# EAGLE design ecoshield (EAGLE 9.6.2)

## Sheet 1 of 2
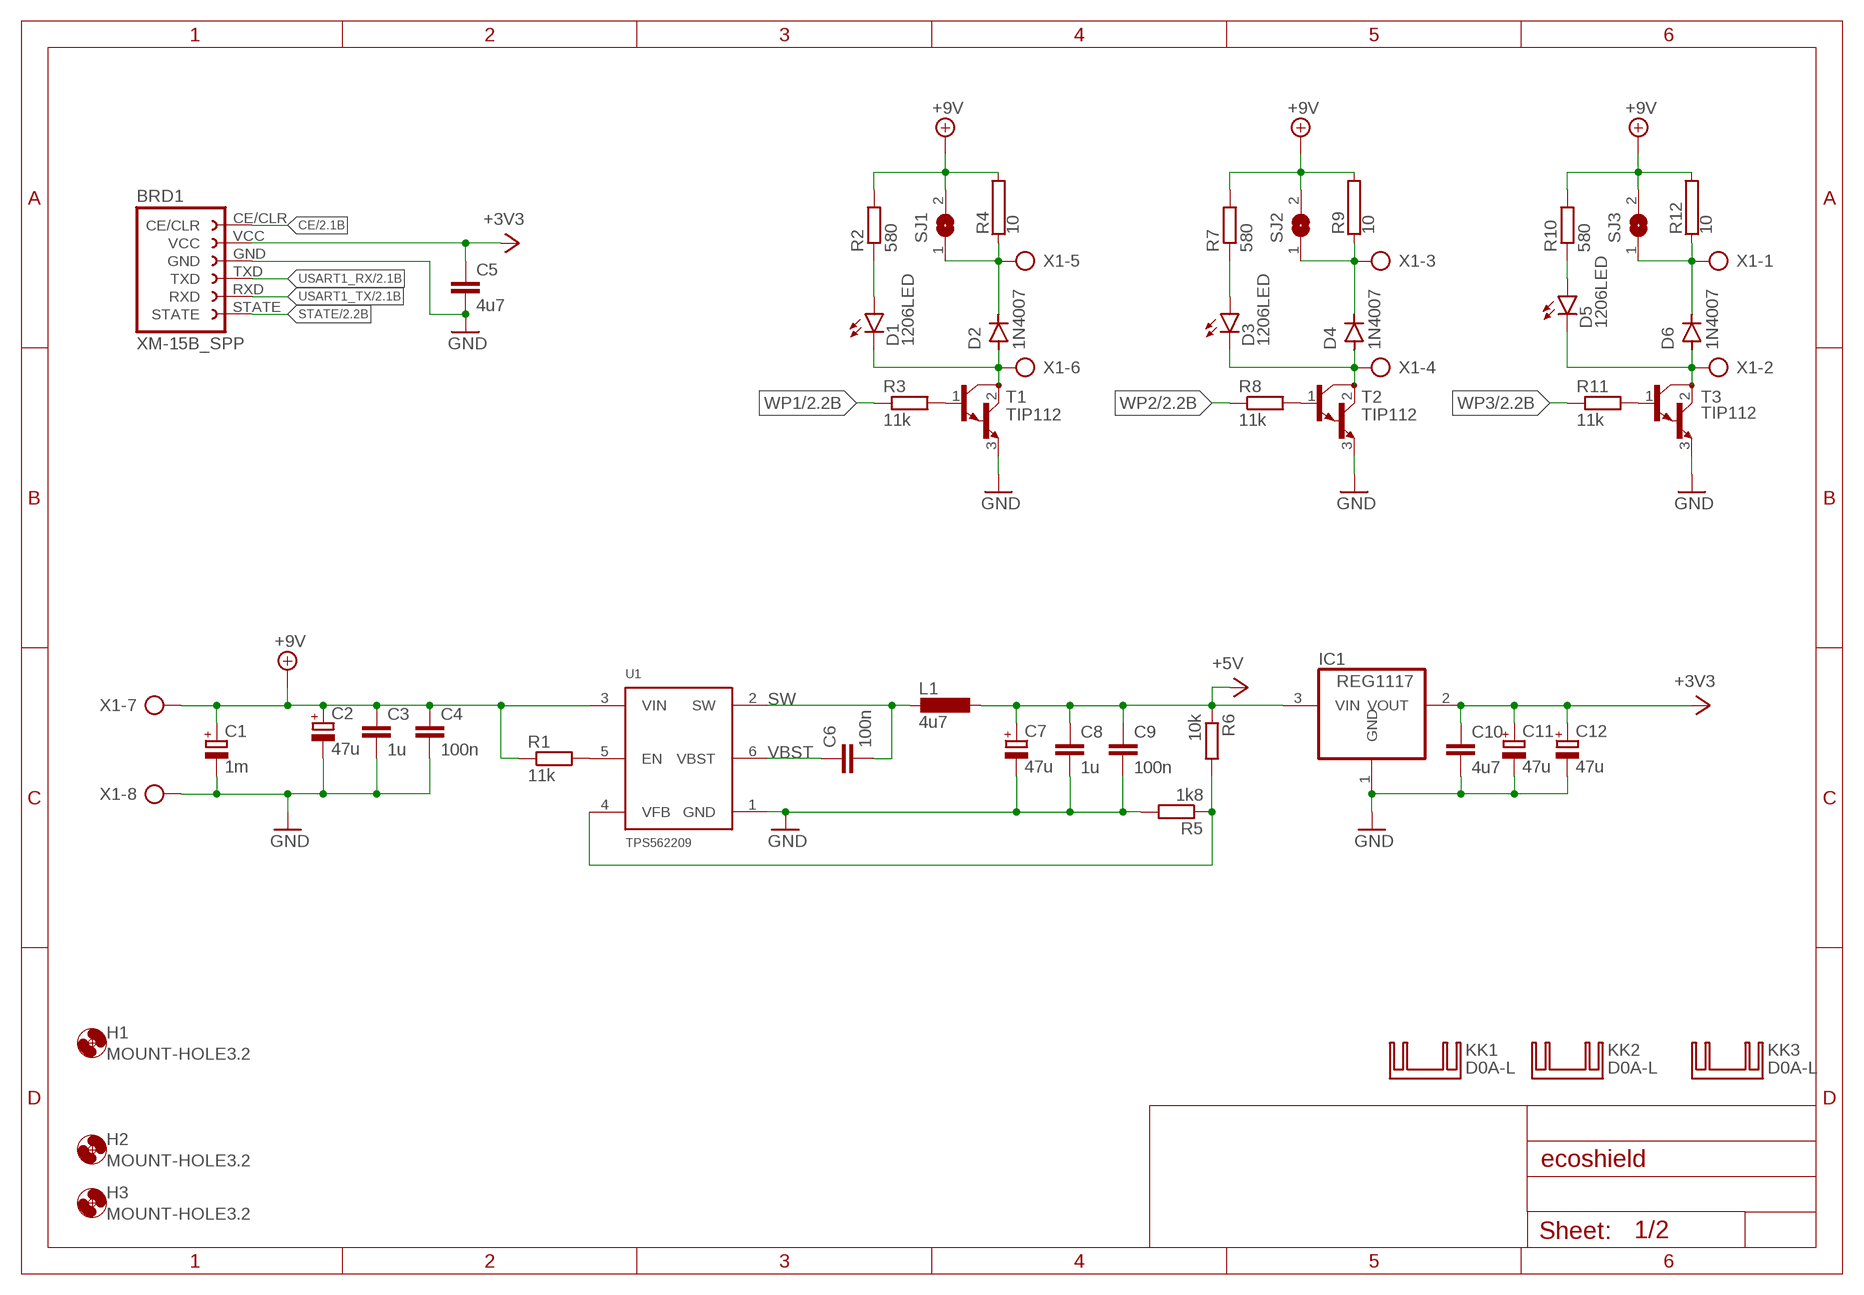
[diagram p0: schematic, sheet 1]

### Parts
BRD1  XM-15B_SPP  [XM-15BSPP]
C1  1m  CPOL-EUE5-10.5  [E5-10,5]
C2  47u  CPOL-EUSMCC  [SMC_C]
C3  1u  C-EUC0805  [C0805]
C4  100n  C-EUC0805  [C0805]
C5  4u7  C-EUC0805  [C0805]
C6  100n  C-EUC0805  [C0805]
C7  47u  CPOL-EUSMCC  [SMC_C]
C8  1u  C-EUC0805  [C0805]
C9  100n  C-EUC0805  [C0805]
C10  4u7  C-EUC0805  [C0805]
C11  47u  CPOL-EUSMCC  [SMC_C]
C12  47u  CPOL-EUSMCC  [SMC_C]
D1  1206LED  [DIOC3216X70N]
D2  1N4007  [DIOMELF4925N]
D3  1206LED  [DIOC3216X70N]
D4  1N4007  [DIOMELF4925N]
D5  1206LED  [DIOC3216X70N]
D6  1N4007  [DIOMELF4925N]
H1  MOUNT-HOLE3.2  [3,2]
H2  MOUNT-HOLE3.2  [3,2]
H3  MOUNT-HOLE3.2  [3,2]
IC1  REG1117  [SOT223]
KK1  D0A-L  [D02A-L]
KK2  D0A-L  [D02A-L]
KK3  D0A-L  [D02A-L]
L1  4u7  744043004  [744043004.]
R1  11k  R-EU_R1206  [R1206]
R2  580  R-EU_R1206  [R1206]
R3  11k  R-EU_R1206  [R1206]
R4  10  RAC05  [AC05]
R5  1k8  R-EU_R1206  [R1206]
R6  10k  R-EU_R1206  [R1206]
R7  580  R-EU_R1206  [R1206]
R8  11k  R-EU_R1206  [R1206]
R9  10  RAC05  [AC05]
R10  580  R-EU_R1206  [R1206]
R11  11k  R-EU_R1206  [R1206]
R12  10  RAC05  [AC05]
SJ1  SJW  [SJW]
SJ2  SJW  [SJW]
SJ3  SJW  [SJW]
T1  TIP112  TIP122  [TO220]
T2  TIP112  TIP122  [TO220]
T3  TIP112  TIP122  [TO220]
U1  TPS562209  [SOT95P280X110-6N]
X1  AK500/8  [AK500/8]

### Nets
+3V3: BRD1.VCC C5.1 C10.1 C11.+ C12.+ IC1.2(VOUT) ; also sheet 2
+5V: C7.+ C8.1 C9.1 IC1.3(VIN) L1.P$1 R6.1
+9V: C1.+ C2.+ C3.1 C4.1 R1.1 R2.2 R4.2 R7.2 R9.2 R10.2 R12.2 SJ1.2 SJ2.2 SJ3.2 U1.3(VIN) X1.7
CE [signal]: BRD1.CE/CLR ; also sheet 2
GND: BRD1.GND C1.- C2.- C3.2 C4.2 C5.2 C7.- C8.2 C9.2 C10.2 C11.- C12.- IC1.1(GND) R5.2 T1.3(E) T2.3(E) T3.3(E) U1.1(GND) X1.8 ; also sheet 2
N$1: R11.2 T3.1(B)
N$2: D3.1(C) D4.2(A) T2.2(C) X1.4
N$3: D4.1(C) R9.1 SJ2.1 X1.3
N$4: R8.2 T2.1(B)
N$5: R1.2 U1.5(EN)
N$6: D6.1(C) R12.1 SJ3.1 X1.1
N$8: D3.2(A) R7.1
N$9: D5.2(A) R10.1
N$10: D5.1(C) D6.2(A) T3.2(C) X1.2
N$11: D1.1(C) D2.2(A) T1.2(C) X1.6
N$12: D2.1(C) R4.1 SJ1.1 X1.5
N$13: R3.2 T1.1(B)
N$15: D1.2(A) R2.1
N$17: R5.1 R6.2 U1.4(VFB)
STATE [signal]: BRD1.STATE ; also sheet 2
SW: C6.2 L1.P$2 U1.2(SW)
USART1_RX [signal]: BRD1.TXD ; also sheet 2
USART1_TX [signal]: BRD1.RXD ; also sheet 2
VBST: C6.1 U1.6(VBST)
WP1 [signal]: R3.1 ; also sheet 2
WP2 [signal]: R8.1 ; also sheet 2
WP3 [signal]: R11.1 ; also sheet 2

## Sheet 2 of 2
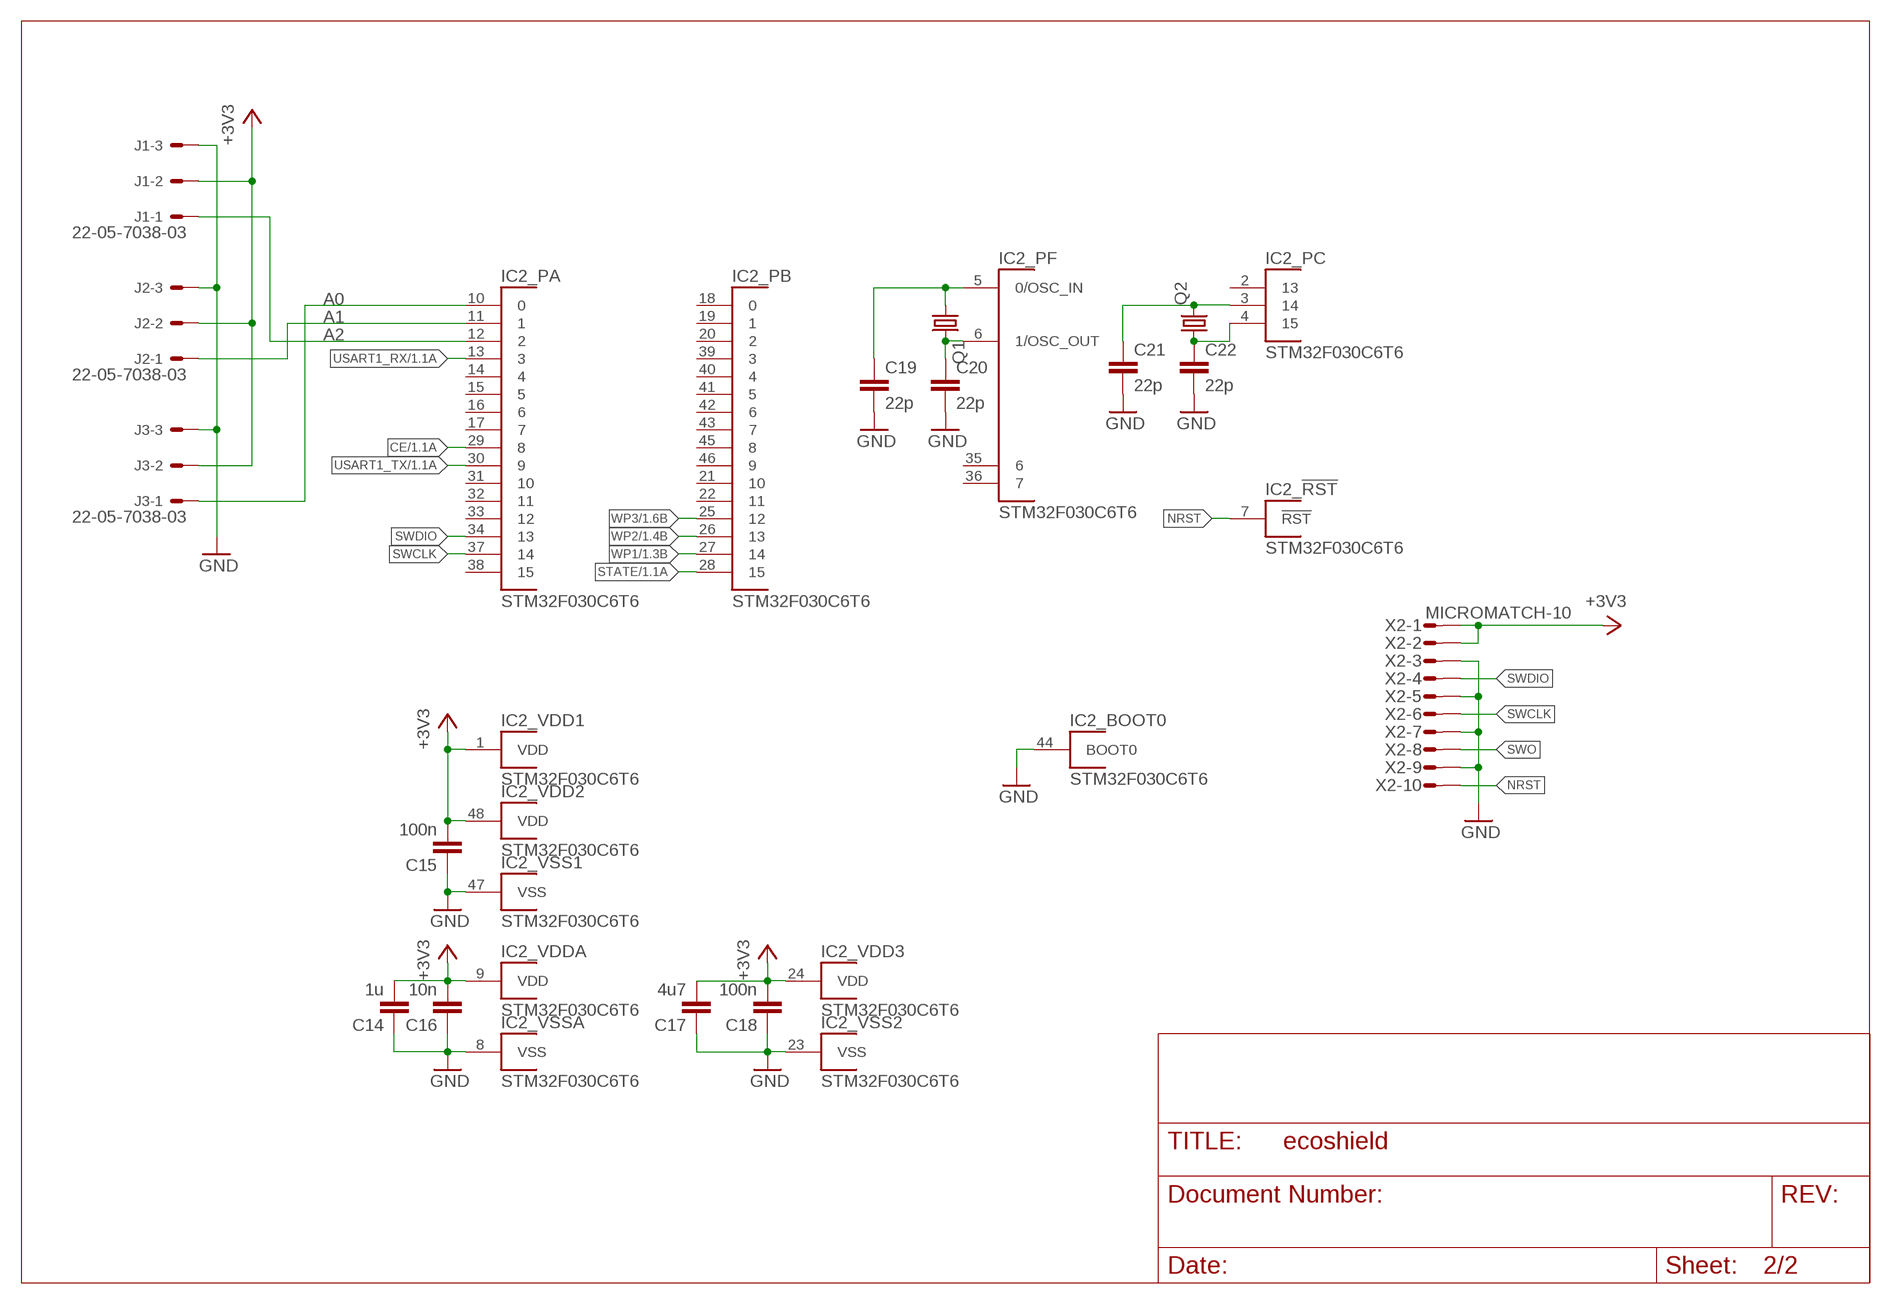
[diagram p1: schematic, sheet 2]

### Parts
C14  1u  C-EUC0805  [C0805]
C15  100n  C-EUC0805  [C0805]
C16  10n  C-EUC0805  [C0805]
C17  4u7  C-EUC0805  [C0805]
C18  100n  C-EUC0805  [C0805]
C19  22p  C-EUC0603  [C0603]
C20  22p  C-EUC0603  [C0603]
C21  22p  C-EUC0603  [C0603]
C22  22p  C-EUC0603  [C0603]
IC2  STM32F030C6T6  [QFP50P900X900X160-48N]
J1  22-05-7038-03  [7395-03]
J2  22-05-7038-03  [7395-03]
J3  22-05-7038-03  [7395-03]
Q1  CRYSTALHC49U-V  [HC49U-V]
Q2  CRYSTALTC38H  [TC38H]
X2  MICROMATCH-10  [MICROMATCH-10]

### Nets
+3V3: C14.2 C15.2 C16.2 C17.2 C18.2 IC2.1(_VDD1:VDD) IC2.9(_VDDA:VDD) IC2.24(_VDD3:VDD) IC2.48(_VDD2:VDD) J1.2 J2.2 J3.2 X2.1 X2.2 ; also sheet 1
A0 [signal]: IC2.10 J3.1
A1 [signal]: IC2.11 J2.1
A2 [signal]: IC2.12 J1.1
CE [signal]: IC2.29 ; also sheet 1
GND: C14.1 C15.1 C16.1 C17.1 C18.1 C19.2 C20.2 C21.2 C22.2 IC2.8(_VSSA:VSS) IC2.23(_VSS2:VSS) IC2.44(_BOOT0:BOOT0) IC2.47(_VSS1:VSS) J1.3 J2.3 J3.3 X2.3 X2.5 X2.7 X2.9 ; also sheet 1
N$7 [signal]: C20.1 IC2.6(_PF:1/OSC_OUT) Q1.2
N$14 [signal]: C19.1 IC2.5(_PF:0/OSC_IN) Q1.1
N$16 [signal]: C22.1 IC2.4 Q2.1
N$18 [signal]: C21.1 IC2.3 Q2.2
NRST [signal]: IC2.7(_!RST:!RST) X2.10
STATE [signal]: IC2.28 ; also sheet 1
SWCLK [signal]: IC2.37 X2.6
SWDIO [signal]: IC2.34 X2.4
SWO [signal]: X2.8
USART1_RX [signal]: IC2.13 ; also sheet 1
USART1_TX [signal]: IC2.30 ; also sheet 1
WP1 [signal]: IC2.27 ; also sheet 1
WP2 [signal]: IC2.26 ; also sheet 1
WP3 [signal]: IC2.25 ; also sheet 1
Unconnected: IC2.2 IC2.14 IC2.15 IC2.16 IC2.17 IC2.18 IC2.19 IC2.20 IC2.21 IC2.22 IC2.31 IC2.32 IC2.33 IC2.35 IC2.36 IC2.38 IC2.39 IC2.40 IC2.41 IC2.42 IC2.43 IC2.45 IC2.46

## Library data of the parts
BRD1 = transistors:XM-15B_SPP: XM-15B SPP Bloetooth Module datasheet <https://download.kamami.pl/p566523-06642%29datasheet.pdf>
C1 C2 C7 C11 C12 = rcl:CPOL-EU: POLARIZED CAPACITOR, European symbol; SPICEPREFIX: C
C3-C6 C8-C10 C14-C22 = rcl:C-EU: CAPACITOR, European symbol; SPICEPREFIX: C
D1 D3 D5 = transistors:1206LED
D2 D4 D6 = transistors:1N4007
H1-H3 = holes:MOUNT-HOLE: MOUNTING HOLE with drill center marker
IC1 = burr-brown:REG1117: 800mA and 1A Low Dropout (LDO) Positive Regulator 1.8V, 2.5V, 2.85V, 3.3V, 5V, and Adj; MPN: REG1117; OC_FARNELL: 1097566; OC_NEWARK: 14P6981
IC2 = grbl_db25:STM32F030C6T6: STM32F030C6T6 - Value-line Arm®-based 32-bit MCU with up to 256 KB Flash, timers, ADC, communication interfaces, 2.4-3.6 V operation
J1-J3 = con-molex:22-?-03: CONNECTOR wire to board 2.54 mm (.1 inch) pitch header; MF: MOLEX; OC_FARNELL: unknown; OC_NEWARK: unknown
KK1-KK3 = heatsink:D0A-L: HEATSINK distributor Schukat
L1 = transistors:744043004: 744043004 Datasheet WE-TPC SMT Shielded Tiny Power Inductor
Q1 = crystal:CRYSTAL: CRYSTAL; OC_FARNELL: 1666969; OC_NEWARK: unknown
Q2 = crystal:CRYSTAL: CRYSTAL; OC_FARNELL: unknown; OC_NEWARK: unknown
R1-R3 R5-R8 R10 R11 = rcl:R-EU_: RESISTOR, European symbol; SPICEPREFIX: R
R4 R9 R12 = resistor-power:R: Power Resitor; OC_FARNELL: unknown; OC_NEWARK: unknown
SJ1-SJ3 = jumper:SJ: SMD solder JUMPER
T1-T3 = transistor-neu-to92:TIP122: NPN BIPOLAR DARLINGTON TRANSISTOR
U1 = transistors:TPS562209: TPS56x209, 4.5V to 17 V Input, 2-A, 3-A Synchronous Step-Down Voltage Regulator in 6 pin SOT-23
X1 = con-ptr500:AK500/8: CONNECTOR; OC_FARNELL: unknown; OC_NEWARK: unknown
X2 = con-amp-micromatch:MICROMATCH-10: MicroMaTch 10 8-215464-0 / 1-215464-0 Drawing Number C-215464 DDEController.pdf; MF: FARNELL; MPN: 8-215464-0; OC_FARNELL: 3784654; OC_NEWARK: 19J6430

## Net classes
0 default: clearance 0.406 mm
1 signal: width 0.203 mm, drill 0.4 mm, clearance 0.406 mm to class 0, clearance 0.203 mm

## Board
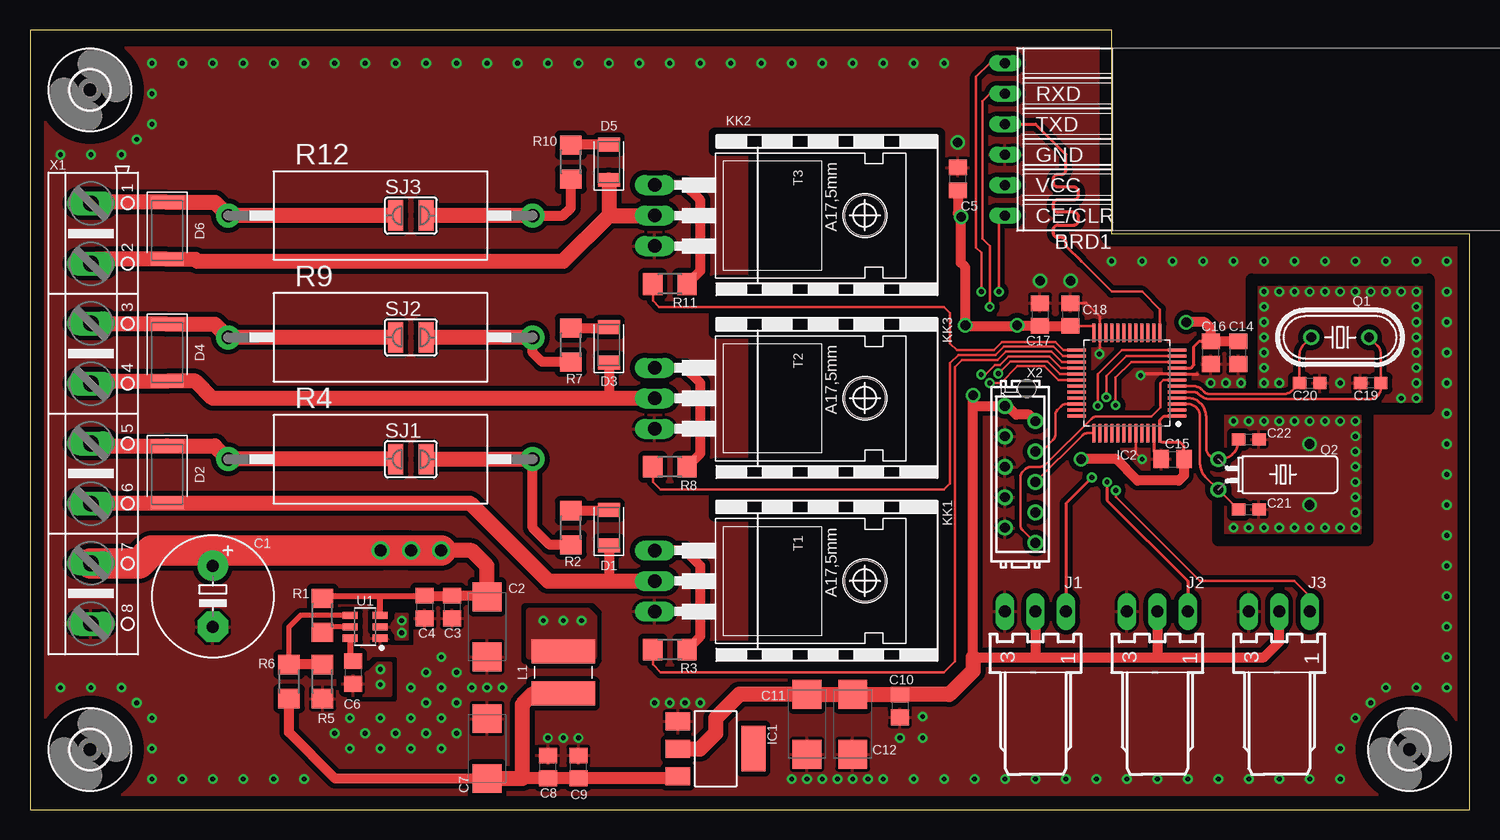
[diagram p2: board, top side]
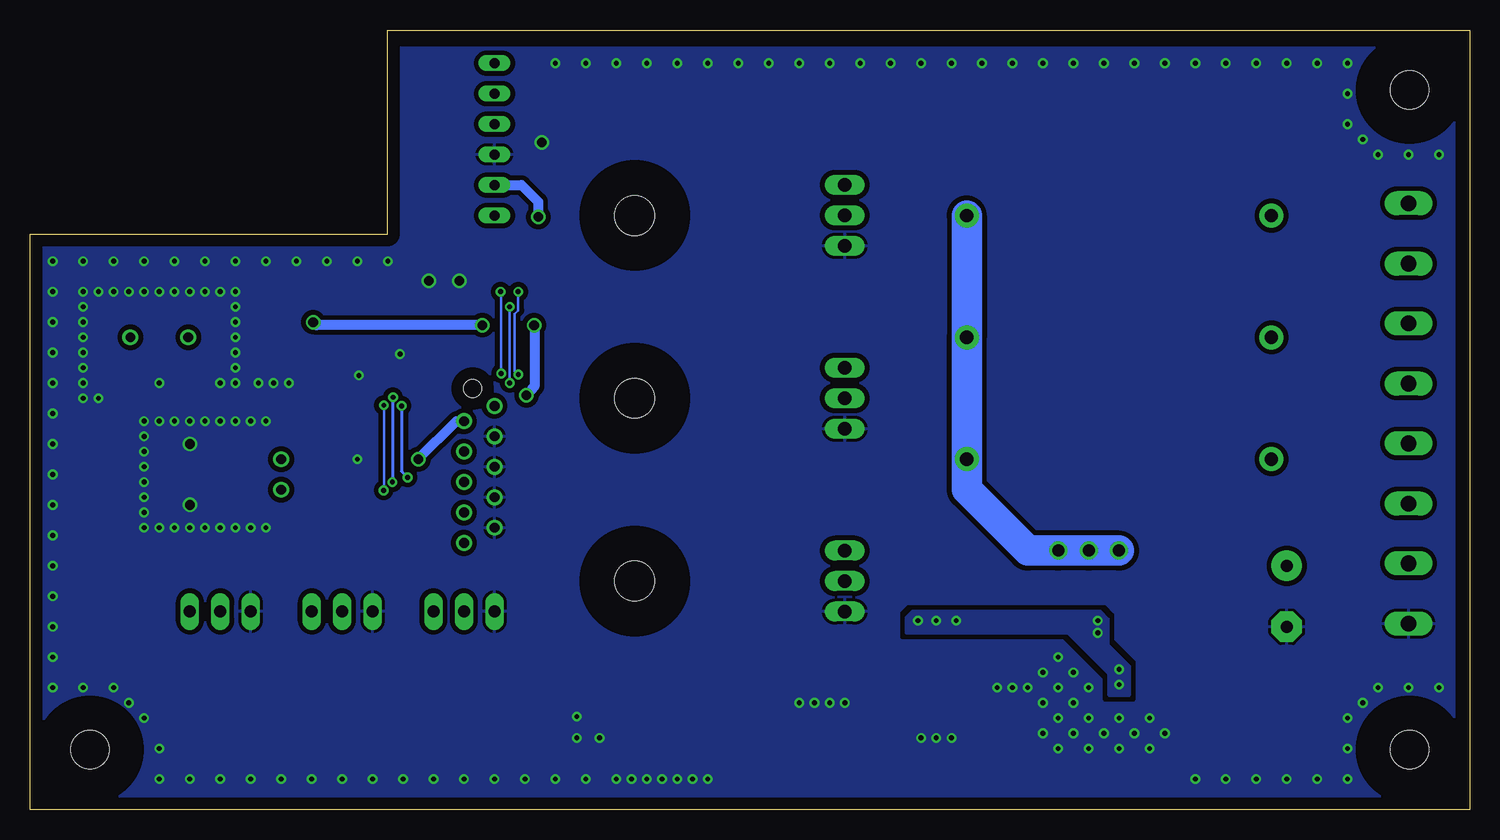
[diagram p3: board, bottom side, seen from below]

Size 120 x 65 mm. Coordinates in mm from the lower left corner, seen from the top.
Outline: 0,0 120,0 120,48 90.17,48 90.17,65 0,65 0,0
Copper layers (1*16): Top 0.035mm / dielectric 1.5mm / Bottom 0.035mm
Design rules "default *": minimum track width 6mil, minimum drill 0.35mm, track to track 6mil, track to pad 6mil, pad to pad 6mil, via to via 6mil, smd to smd 6mil, copper to edge 40mil, drill to drill 6mil, minimum pad ring 10mil, minimum via ring 8mil, stop-mask expansion 4mil, vias tented up to drill 0.4mm, thermal gap 10mil
tRestrict: 9 lines

### Footprints (pad centres in the part's own frame; a part is rotated, then mirrored left to right if it is on the bottom)
XM-15BSPP = drill 0.813 long: CE/CLR 6.35,-2.54; GND 1.27,-2.54; RXD -3.81,-2.54; STATE -6.35,-2.54; TXD -1.27,-2.54; VCC 3.81,-2.54
E5-10,5 = drill 1.016 pad 2.54: + -2.54,0 | drill 1.016 pad 2.54 octagon: - 2.54,0
SMC_C = smd 2.4 x 2.4: + -2.5,0; - 2.5,0
C0805 = smd 1.3 x 1.5: 1 -0.95,0; 2 0.95,0
C0603 = smd 1.1 x 1: 1 -0.85,0; 2 0.85,0
DIOC3216X70N = smd 1.165 x 1.815: 1 -1.475,0; 2 1.475,0
DIOMELF4925N = smd 1.073 x 2.729: 1 -2.378,0; 2 2.378,0
3,2 = hole 3.2: 0,0
SOT223 = smd 1.499 x 2.007: 1 -2.261,-3.15; 2 0.025,-3.15; 3 2.311,-3.15 | smd 3.81 x 2.007: 4 0,3.15
QFP50P900X900X160-48N = smd 1.559 x 0.28: 1 -4.178,2.75; 2 -4.178,2.25; 3 -4.178,1.75; 4 -4.178,1.25; 5 -4.178,0.75; 6 -4.178,0.25; 7 -4.178,-0.25; 8 -4.178,-0.75; 9 -4.178,-1.25; 10 -4.178,-1.75; 11 -4.178,-2.25; 12 -4.178,-2.75; 25 4.178,-2.75; 26 4.178,-2.25; 27 4.178,-1.75; 28 4.178,-1.25; 29 4.178,-0.75; 30 4.178,-0.25; 31 4.178,0.25; 32 4.178,0.75; 33 4.178,1.25; 34 4.178,1.75; 35 4.178,2.25; 36 4.178,2.75 | smd 0.28 x 1.559: 13 -2.75,-4.178; 14 -2.25,-4.178; 15 -1.75,-4.178; 16 -1.25,-4.178; 17 -0.75,-4.178; 18 -0.25,-4.178; 19 0.25,-4.178; 20 0.75,-4.178; 21 1.25,-4.178; 22 1.75,-4.178; 23 2.25,-4.178; 24 2.75,-4.178; 37 2.75,4.178; 38 2.25,4.178; 39 1.75,4.178; 40 1.25,4.178; 41 0.75,4.178; 42 0.25,4.178; 43 -0.25,4.178; 44 -0.75,4.178; 45 -1.25,4.178; 46 -1.75,4.178; 47 -2.25,4.178; 48 -2.75,4.178
7395-03 = drill 1.016 long: 1 2.54,0; 2 0,0; 3 -2.54,0
744043004. = smd 5.3 x 2: P$1 0,-1.75; P$2 0,1.75
HC49U-V = drill 0.813: 1 -2.413,0; 2 2.413,0
TC38H = drill 0.813: 1 -1.27,0; 2 1.27,0
R1206 = smd 1.6 x 1.803: 1 -1.422,0; 2 1.422,0
AC05 = drill 1.1 pad 2: 1 -12.7,0; 2 12.7,0
SJW = smd 1.27 x 2.54: 1 -1.27,0; 2 1.27,0
TO220 = drill 1.118 long: 1 -2.54,-6.35; 2 0,-6.35; 3 2.54,-6.35 | hole 3.302: 0,11.176
SOT95P280X110-6N = smd 1.257 x 0.598: 1 -1.253,0.95; 2 -1.253,0; 3 -1.253,-0.95; 4 1.253,-0.95; 5 1.253,0; 6 1.253,0.95
AK500/8 = drill 1.321 long: 1 -17.526,0; 2 -12.497,0; 3 -7.518,0; 4 -2.489,0; 5 2.489,0; 6 7.518,0; 7 12.497,0; 8 17.526,0
MICROMATCH-10 = drill 0.813: 1 5.715,1.27; 2 4.445,-1.27; 3 3.175,1.27; 4 1.905,-1.27; 5 0.635,1.27; 6 -0.635,-1.27; 7 -1.905,1.27; 8 -3.175,-1.27; 9 -4.445,1.27; 10 -5.715,-1.27 | hole 1.5: 7.16,-0.55

### Placement (x,y rotation side)
BRD1  83.82,55.88 270 top
C1  15.24,17.78 270 top
C2  38.1,15.24 270 top
C3  35.18,16.89 270 top
C4  32.89,16.89 270 top
C5  77.34,52.58 90 top
C6  26.92,11.43 270 top
C7  38.1,5.08 90 top
C8  43.18,3.56 90 top
C9  45.72,3.56 90 top
C10  72.52,8.64 270 top
C11  64.77,7.11 270 top
C12  68.58,7.11 270 top
C14  100.71,38.1 90 top
C15  95.25,29.21 0 top
C16  98.42,38.1 90 top
C17  84.2,41.27 270 top
C18  86.74,41.27 270 top
C19  111.76,35.56 180 top
C20  106.68,35.56 0 top
C21  101.6,25.02 0 top
C22  101.6,30.86 0 top
D1  48.26,23.5 90 top
D2  11.43,27.94 270 top
D3  48.26,38.73 90 top
D4  11.43,38.1 270 top
D5  48.26,53.98 90 top
D6  11.43,48.26 270 top
H1  115,5 0 top
H2  5,60 0 top
H3  5,5 0 top
IC1  57.15,5.08 270 top
IC2  91.44,35.56 180 top
J1  83.82,16.51 0 top
J2  93.98,16.51 0 top
J3  104.14,16.51 0 top
KK1  64.14,19.05 180 top
KK2  64.14,49.53 180 top
KK3  64.14,34.29 180 top
L1  44.45,11.43 0 top
Q1  109.22,39.37 180 top
Q2  99.06,27.94 270 top
R1  24.38,16.19 270 top
R2  45.09,23.5 270 top
R3  53.34,13.34 0 top
R4  29.21,29.21 0 top
R5  24.38,10.67 270 top
R6  21.59,10.67 90 top
R7  45.09,38.73 270 top
R8  53.34,28.57 0 top
R9  29.21,39.37 0 top
R10  45.09,53.98 270 top
R11  53.34,43.81 0 top
R12  29.21,49.53 0 top
SJ1  31.75,29.21 0 top
SJ2  31.75,39.37 0 top
SJ3  31.75,49.53 0 top
T1  58.42,19.05 270 top
T2  58.42,34.29 270 top
T3  58.42,49.53 270 top
U1  27.94,15.24 180 top
X1  5.08,33.02 270 top
X2  82.55,27.94 90 top

### Tracks (layer width: path | path; a pad name or v marks a point on that pad's centre or on a via)
+3V3  (via drill 0.8)
  Top 0.203: IC2.24 88.69,40.33 C18.2
  Top 0.254: IC2.9 96.75,36.81 97.03,37.08 97.03,38.61 97.47,39.05 C16.2 | C15.2 96.2,30.29 95.89,30.61 94.36,30.61 94.19,30.78 IC2.48 94.19,32.47 94.53,32.81 IC2.1
  Top 0.813: 78.61,33.66 X2.1 81.47,33.66 82.2,32.93 83.28,32.93 X2.2 | 78.61,33.66 78.61,12.7 83.82,12.7 | 78.61,33.66 v78.61,34.54 | C18.2 C17.2 82.23,40.33 | 82.23,40.33 v82.3,40.39 | v96.39,40.64 97.92,40.64 98.42,40.13 C16.2 C14.2 | 82.23,40.33 82.23,40.32 78.04,40.32 v77.98,40.39 77.98,45.21 77.6,45.59 77.6,49.37 v77.63,49.4 77.34,49.69 C5.1 | C15.2 96.2,27.87 95.76,27.43 92.33,27.43 90.55,29.21 v87.63,29.21 | 83.82,12.7 93.98,12.7 | 93.98,12.7 102.87,12.7 104.14,13.97 J3.2 | J2.2 93.98,12.7 | J1.2 83.82,12.7 | 72.49,9.61 C10.1
  Top 1.27: IC1.2 55.85,5.05 57.15,6.35 57.15,7.62 59.14,9.61 C11.+ C12.+ 72.49,9.61 | 78.61,12.7 78.61,11.56 76.64,9.59 C10.1
  Bottom 0.813: v82.3,40.39 96.14,40.39 v96.39,40.64 | X2.2 84.45,32.38 v87.63,29.21 | v78.61,34.54 78.11,35.05 78.11,35.11 77.95,35.26 77.95,40.36 v77.98,40.39 | BRD1.VCC 79.03,52.07 77.63,50.67 v77.63,49.4
+5V
  Top 0.813: R6.1 21.59,6.43 25.44,2.58 C7.+
  Top 1.016: 41.02,2.58 41.02,2.61 C8.1 C9.1 54,2.61 IC1.3
  Top 1.27: L1.P$1 41.94,9.68 41.02,8.76 41.02,2.58 C7.+
+9V  (via drill 1)
  Top 0.508: U1.3 29.19,17.78 | 29.19,17.78 32.81,17.78 C4.1 | 29.19,17.78 24.55,17.78 R1.1
  Top 0.813: R12.2 44.45,49.53 45.09,50.16 R10.2 | R7.2 42.7,37.31 41.91,38.1 R9.2 | R2.2 43.33,22.07 41.91,23.5 R4.2 | C2.+ 38,17.84 C3.1 35.12,17.78 32.81,17.78
  Top 1.27: SJ1.2 R4.2 | R9.2 SJ2.2 | R12.2 SJ3.2 | C2.+ 38.1,20.32 36.83,21.59 v34.29,21.59
  Top 2.54: v34.29,21.59 v31.75,21.59 v29.21,21.59 15.24,21.59 | 15.24,21.59 10.16,21.59 9.09,20.52 X1.7 | C1.+ 15.24,21.59
  Bottom 2.54: v29.21,21.59 v31.75,21.59 v34.29,21.59 36.83,21.59 41.91,26.67 R4.2 R9.2 R12.2
A0  (via drill 0.4)
  Top 0.203: IC2.10 91.79,37.31 90.5,36.01 v90.5,33.71 | v90.52,26.61 90.52,26.06 97.54,19.05 105.41,19.05 106.68,17.78 J3.1
  Bottom 0.203: v90.5,33.71 90.5,26.64 v90.52,26.61
A1  (via drill 0.4)
  Top 0.203: IC2.11 91.4,37.81 89.73,36.14 v89.73,34.38
  Top 0.254: v89.79,27.3 89.79,25.78 96.52,19.05 J2.1
  Bottom 0.254: v89.73,34.38 89.73,33.98 89.76,33.96 89.76,27.33 v89.79,27.3
A2  (via drill 0.4)
  Top 0.203: IC2.12 91.02,38.31 89.03,36.32 v89.03,33.66
  Top 0.254: v88.52,27.69 86.36,25.53 J1.1
  Bottom 0.254: v89.03,33.66 89.03,28.19 v88.52,27.69
CE  (via drill 0.4)
  Top 0.203: IC2.29 85.86,36.31 84.8,37.37 81.73,37.37 v80.72,36.36 | v80.77,43.18 80.77,49.02 BRD1.CE/CLR
  Bottom 0.203: v80.72,36.36 80.72,43.13 v80.77,43.18
GND  (via drill 0.4, 0.8)
  Top 0.203: C18.1 88.08,42.23 89.19,41.11 IC2.23 89.19,38.01 v89.15,37.97 | IC2.44 92.19,29.73 v92.71,29.21
  Top 0.254: IC2.47 93.69,29.82 C15.1 | 97.33,36.31 IC2.8 92.7,36.31 v92.58,36.2
  Top 0.508: U1.1 29.21,14.27
  other vias: 35.56,11.43 34.29,12.7 33.02,11.43 34.29,10.16 31.75,10.16 33.02,8.89 34.29,7.62 31.75,7.62 29.21,7.62 26.67,7.62 33.02,6.35 30.48,6.35 27.94,6.35 43.18,5.97 45.72,5.97 36.83,10.16 38.1,10.16 39.37,10.16 34.29,5.08 31.75,5.08 29.21,5.08 26.67,5.08 35.56,8.89 35.56,6.35 25.4,6.35 44.45,5.97 100.33,32.38 102.87,32.38 101.6,32.38 100.33,23.5 101.6,23.5 102.87,23.5 104.14,23.5 105.41,23.5 106.68,23.5 107.95,23.5 109.22,23.5 110.49,23.5 110.49,24.77 110.49,26.04 110.49,27.3 110.49,28.57 110.49,29.84 110.49,31.11 110.49,32.38 109.22,32.38 107.95,32.38 106.68,32.38 105.41,32.38 104.14,32.38 84.2,44.07 106.68,30.48 106.68,25.4 98.42,35.56 86.74,44.07 77.34,55.63 52.07,8.89 53.34,8.89 54.61,8.89 55.88,8.89 63.5,2.54 64.77,2.54 66.04,2.54 74.42,7.75 74.42,5.97 72.52,5.97 67.31,2.54 68.58,2.54 69.85,2.54 99.69,35.56 100.97,35.56 109.22,35.56 115.57,34.29 115.57,35.56 115.57,36.83 115.57,38.1 114.3,34.29 115.57,39.37 115.57,40.64 115.57,41.91 115.57,43.18 114.3,43.18 113.03,43.18 111.76,43.18 110.49,43.18 109.22,43.18 107.95,43.18 106.68,43.18 105.41,43.18 104.14,43.18 102.87,43.18 102.87,41.91 102.87,40.64 102.87,39.37 102.87,38.1 102.87,36.83 102.87,35.56 104.14,35.56 10.16,62.23 12.7,62.23 15.24,62.23 10.16,59.69 10.16,57.15 8.89,55.88 7.62,54.61 5.08,54.61 2.54,54.61 17.78,62.23 20.32,62.23 22.86,62.23 25.4,62.23 27.94,62.23 30.48,62.23 33.02,62.23 35.56,62.23 38.1,62.23 40.64,62.23 43.18,62.23 45.72,62.23 48.26,62.23 50.8,62.23 53.34,62.23 55.88,62.23 58.42,62.23 60.96,62.23 63.5,62.23 66.04,62.23 68.58,62.23 71.12,62.23 73.66,62.23 76.2,62.23 111.76,8.89 110.49,7.62 113.03,10.16 109.22,5.08 115.57,10.16 118.11,10.16 118.11,12.7 118.11,15.24 118.11,17.78 118.11,20.32 118.11,22.86 118.11,25.4 118.11,27.94 118.11,30.48 118.11,33.02 118.11,35.56 118.11,38.1 118.11,40.64 118.11,43.18 118.11,45.72 115.57,45.72 113.03,45.72 110.49,45.72 107.95,45.72 105.41,45.72 102.87,45.72 100.33,45.72 97.79,45.72 95.25,45.72 92.71,45.72 90.17,45.72 2.54,10.16 5.08,10.16 7.62,10.16 8.89,8.89 10.16,7.62 10.16,5.08 10.16,2.54 12.7,2.54 15.24,2.54 17.78,2.54 20.32,2.54 22.86,2.54 109.22,2.54 106.68,2.54 104.14,2.54 101.6,2.54 99.06,2.54 96.52,2.54 93.98,2.54 91.44,2.54 88.9,2.54 86.36,2.54 83.82,2.54 81.28,2.54 78.74,2.54 76.2,2.54 73.66,2.54 71.12,2.54
  pour Top (isolate 0.406, rank 2): 1.27,1.27 119.38,1.27 119.38,63.5 1.27,63.5
  pour Bottom (isolate 0.406, rank 2): 1.27,63.5 119.38,63.5 119.38,0 1.27,0
N$1
  Top 0.813: R11.2 55.88,44.93 55.88,50.8 54.61,52.07 T3.1
N$2
  Top 0.813: D3.1 48.26,34.29
  Top 1.27: X1.4 5.29,35.72 D4.2 13.81,35.72 15.24,34.29 48.26,34.29 T2.2
N$3
  Top 1.27: SJ2.1 R9.1 15.4,40.48 D4.1 5.14,40.48 X1.3
N$4
  Top 0.813: R8.2 55.88,29.69 55.88,35.56 54.61,36.83 T2.1
N$5
  Top 0.406: U1.5 24.86,15.24 R1.2
N$6
  Top 1.27: SJ3.1 R12.1 15.4,50.64 D6.1 5.17,50.64 X1.1
N$7
  Top 0.203: IC2.6 96.97,35.31 arc-45 97.68,35.02 97.86,34.84 arc45 98.31,34.65 104.5,34.65 arc45 105.21,34.94 C20.1 105.83,37.98 arc-45 106.12,38.69 Q1.2
N$8
  Top 0.813: R7.1 48.21,40.16 D3.2
N$9
  Top 0.813: D5.2 45.14,55.45 R10.1
N$10
  Top 1.27: 48.26,49.53 T3.2 | 48.26,49.53 44.45,45.72 13.97,45.72 13.81,45.88 D6.2 5.45,45.88 X1.2 | D5.1 48.26,49.53
N$11
  Top 0.813: D1.1 48.26,19.05
  Top 1.27: X1.6 5.14,25.56 D2.2 36.67,25.56 43.18,19.05 48.26,19.05 T1.2
N$12
  Top 1.27: SJ1.1 R4.1 15.4,30.32 D2.1 5.29,30.32 X1.5
N$13
  Top 0.813: R3.2 55.88,14.45 55.88,20.32 54.61,21.59 T1.1
N$14
  Top 0.203: IC2.5 97.01,34.81 arc-45 97.46,34.62 97.55,34.53 arc45 98.25,34.24 111.78,34.24 arc45 112.32,34.47 arc45 112.61,35.17 C19.1 112.61,37.98 arc45 112.32,38.69 Q1.1
N$15
  Top 0.813: R2.1 48.21,24.92 D1.2
N$16
  Top 0.203: C22.1 arc-90 99.23,29.21 Q2.1 arc-90 98.04,30.23 98.04,32.77 arc45 97.59,33.85 97.54,33.91 arc45 96.57,34.31 IC2.4
N$17
  Top 0.406: U1.4 22.55,16.19 21.59,15.23 R6.2
  Top 0.813: R5.1 R6.2
N$18
  Top 0.203: C21.1 100.71,25.02 Q2.2 97.98,27.75 arc-45 97.54,28.83 97.54,32.79 arc90 96.51,33.81 IC2.3 96.3,33.81
NRST
  Top 0.203: IC2.7 94.48,35.81 94.23,35.56 94.23,33.53 93.47,32.77 88.91,32.77 arc45 88.46,32.58 84.64,28.76 arc-45 84.19,28.57 83.45,28.57 arc45 83,28.39 82.74,28.13 arc45 82.55,27.68 82.55,23.76 arc45 82.74,23.31 X2.10
STATE  (via drill 0.4)
  Top 0.203: IC2.28 85.94,36.81 84.97,37.78 81.56,37.78 80.85,37.07 80.42,37.07 79.63,36.27 v79.3,36.27 | v79.3,43.18 79.3,46.43 78.87,46.86 78.87,61.09 80.01,62.23 BRD1.STATE
  Bottom 0.203: v79.3,36.27 79.6,36.58 79.6,41.31 79.3,41.62 v79.3,43.18
SW  (via drill 0.4)
  other vias: 30.99,15.75 30.99,14.73 42.8,15.75 44.45,15.75 45.97,15.75 29.21,11.68 29.21,10.41
  pour Bottom (isolate 0.406): 28.32,9.53 28.32,11.94 30.1,13.72 30.1,15.88 30.73,16.51 46.48,16.51 46.99,16 46.99,14.73 33.53,14.73 30.1,11.3 30.1,9.53
  pour Top (isolate 0.406): 26.04,9.53 30.1,9.53 30.1,12.19 28.96,12.19 28.19,11.43 26.04,11.43
  pour Top (isolate 0.406): 28.7,15.11 29.97,15.11 30.48,14.61 30.48,14.22 31.5,14.22 31.5,16.26 30.48,16.26 30.48,15.88 29.97,15.37 28.7,15.37
  pour Top (isolate 0.406, no thermals): 41.66,12.83 41.66,16.51 46.48,16.51 46.99,16 46.99,12.83
SWCLK
  Top 0.203: X2.6 87.71,31.2 arc-45 88.16,31.38 IC2.37
SWDIO
  Top 0.203: X2.4 84.06,29.84 arc45 84.51,30.03 85.28,30.8 arc45 85.47,31.25 85.47,32.88 arc-45 85.66,33.33 85.95,33.62 arc-45 86.4,33.81 IC2.34
USART1_RX
  Top 0.203: 87.63,45.72 90.17,43.18 92.71,43.18 94.19,41.7 IC2.13
  Top 0.254: BRD1.TXD 83.82,57.15 86.36,54.61 86.36,53.34 arc-90 85.98,52.96 85.69,52.96 arc90 85.31,52.58 85.31,52.29 arc90 85.69,51.91 87.03,51.91 arc-90 87.41,51.52 87.41,51.23 arc-90 87.03,50.85 85.69,50.85 arc90 85.31,50.47 85.31,50.18 arc90 85.69,49.8 87.03,49.8 arc-90 87.41,49.42 87.41,49.12 arc-90 87.03,48.74 85.69,48.74 arc90 85.31,48.36 85.31,48.07 arc90 85.69,47.69 85.98,47.69 arc-90 86.36,47.31 86.36,46.99 87.63,45.72
USART1_TX  (via drill 0.4)
  Top 0.203: IC2.30 85.73,35.81 84.57,36.97 82.33,36.97 80.92,35.56 v80.01,35.56 | v80.01,41.91 80.01,46.99 79.38,47.62 79.38,59.05 80.01,59.69 BRD1.RXD
  Bottom 0.203: v80.01,41.91 v80.01,35.56
VBST
  Top 0.508: C6.1 26.92,12.4 26.69,12.64 U1.6
WP1
  Top 0.203: R3.1 51.92,12.09 52.58,11.43 76.2,11.43 77.11,12.34 77.11,36.92 77.67,37.48 80.66,37.48 81.37,38.19 85.14,38.19 86.01,37.31 IC2.27
WP2
  Top 0.203: R8.1 51.92,27.33 52.58,26.67 76.2,26.67 76.71,27.18 76.71,37.21 77.38,37.88 80.49,37.88 81.2,38.59 85.31,38.59 86.09,37.81 IC2.26
WP3
  Top 0.203: R11.1 51.92,42.44 52.45,41.91 76.2,41.91 76.71,41.4 76.71,38.86 77.26,38.31 80.34,38.31 81.03,39 85.47,39 86.16,38.31 IC2.25